# Altium schematic sheet Microcontroller.SchDoc: Microcontroller
size Letter; Date: Jul 31/2018; Revision: 1; SheetNumber: 2; SheetTotal: 9
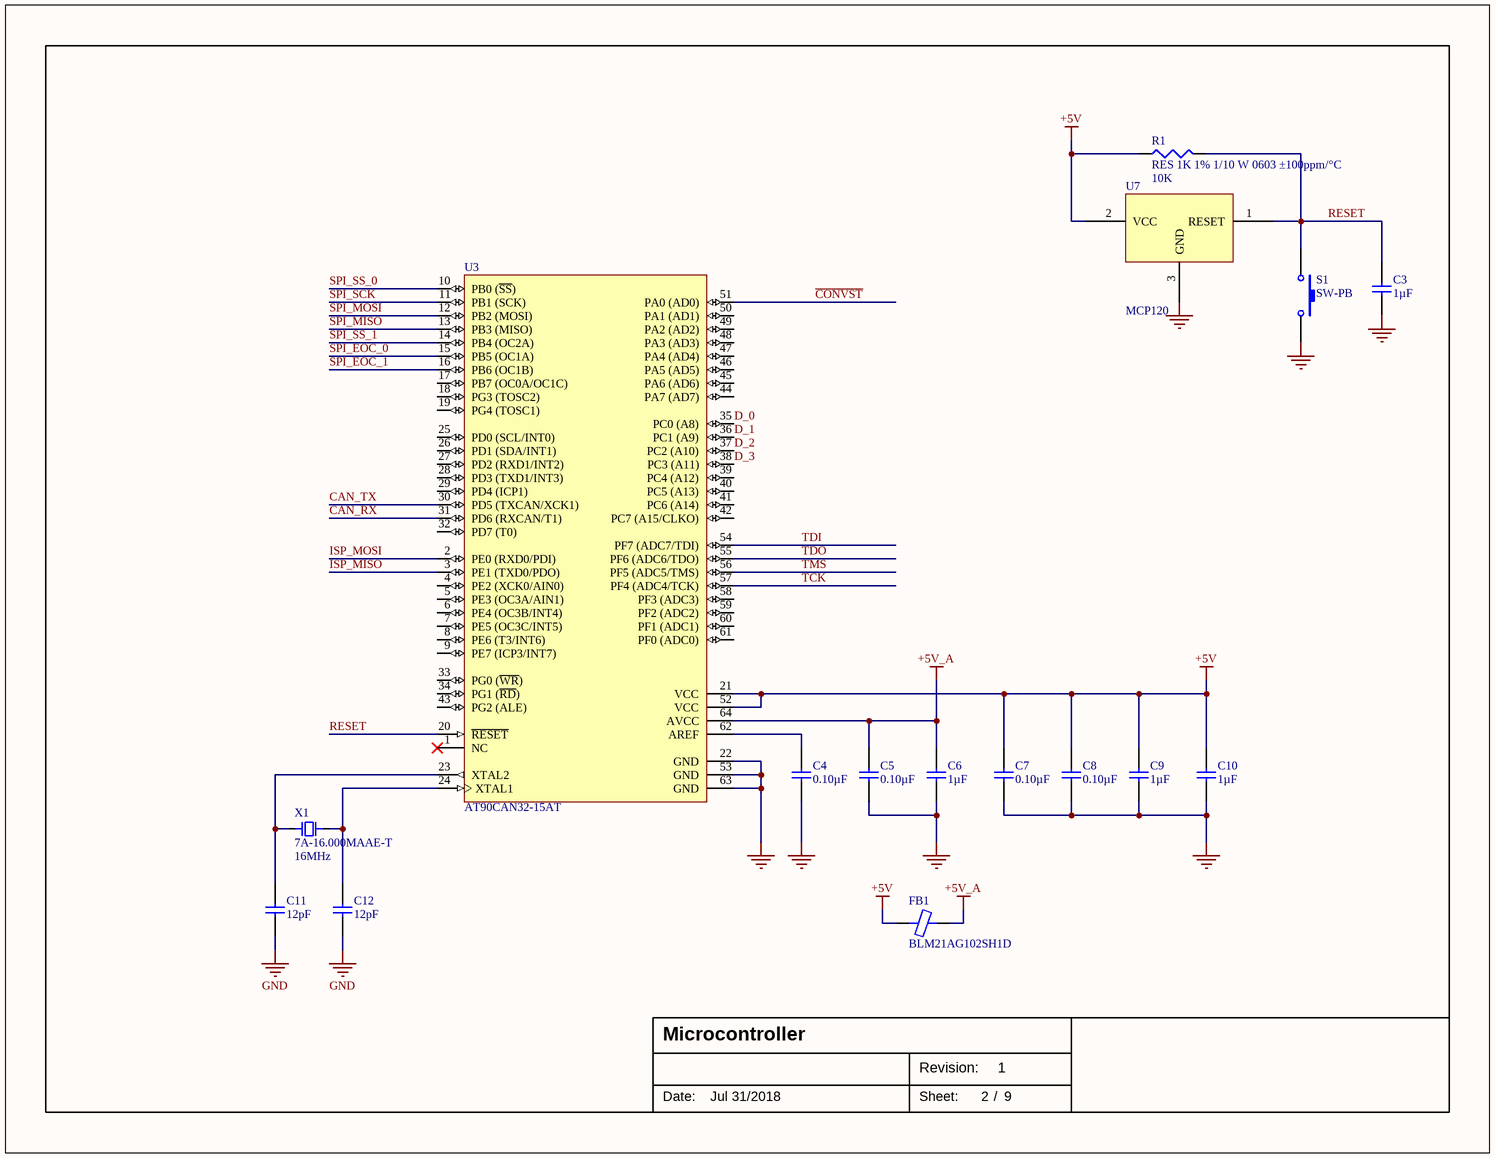
[diagram p0: Microcontroller.SchDoc]

## Parts
C3  value 1µF  [1206]  (hidden comment: CAP 1µF ±10% 16V 0805 X7R)
C4  value 0.10µF  [1206]  (hidden comment: CAP 0.10µF ±10% 16V 0402 X7R)
C5  value 0.10µF  [1206]  (hidden comment: CAP 0.10µF ±10% 16V 0402 X7R)
C6  value 1µF  [1206]  (hidden comment: CAP 1µF ±10% 16V 0805 X7R)
C7  value 0.10µF  [1206]  (hidden comment: CAP 0.10µF ±10% 16V 0402 X7R)
C8  value 0.10µF  [1206]  (hidden comment: CAP 0.10µF ±10% 16V 0402 X7R)
C9  value 1µF  [1206]  (hidden comment: CAP 1µF ±10% 16V 0805 X7R)
C10  value 1µF  [1206]  (hidden comment: CAP 1µF ±10% 16V 0805 X7R)
C11  value 12pF  [1206]  (hidden comment: CAP 12pF ±5% 50V 0402 C0G, NP0)
C12  value 12pF  [1206]  (hidden comment: CAP 12pF ±5% 50V 0402 C0G, NP0)
FB1  BLM21AG102SH1D  [INDC2012X11N]
R1  RES 1K 1% 1/10 W 0603 ±100ppm/°C  value 10K  [1206]
S1  SW-PB  [Switch]
U3  AT90CAN32-15AT  [TQFP80P1600X1600X120-64N]
U7  MCP120  [MCP120]
X1  7A-16.000MAAE-T  value 16MHz  [QFN200P500X320X135-2N]

## Nets
+5V: C7.2 C8.2 C9.1 C10.1 FB1.1 R1.1 U3.21(VCC) U3.52(VCC) U7.2(VCC)
+5V_A: C5.2 C6.1 FB1.2 U3.64(AVCC)
GND: C3.2 C4.1 C5.1 C6.2 C7.1 C8.1 C9.2 C10.2 C11.1 C12.1 S1.2 U3.22(GND) U3.53(GND) U3.63(GND) U7.3(GND)
~{CONVST}: U3.51(PA0_(AD0))
CAN_RX: U3.31(PD6_(RXCAN/T1))
CAN_TX: U3.30(PD5_(TXCAN/XCK1))
D_0: U3.35(PC0_(A8))
D_1: U3.36(PC1_(A9))
D_2: U3.37(PC2_(A10))
D_3: U3.38(PC3_(A11))
ISP_MISO: U3.3(PE1_(TXD0/PDO))
ISP_MOSI: U3.2(PE0_(RXD0/PDI))
RESET: C3.1 R1.2 S1.1 U3.20(~{RESET}) U7.1(RESET)
SPI_EOC_0: U3.15(PB5_(OC1A))
SPI_EOC_1: U3.16(PB6_(OC1B))
SPI_MISO: U3.13(PB3_(MISO))
SPI_MOSI: U3.12(PB2_(MOSI))
SPI_SCK: U3.11(PB1_(SCK))
SPI_SS_0: U3.10(PB0_(~{SS}))
SPI_SS_1: U3.14(PB4_(OC2A))
TCK: U3.57(PF4_(ADC4/TCK))
TDI: U3.54(PF7_(ADC7/TDI))
TDO: U3.55(PF6_(ADC6/TDO))
TMS: U3.56(PF5_(ADC5/TMS))
NetC4_2: C4.2 U3.62(AREF)
NetC11_2: C11.2 U3.23(XTAL2) X1.1
NetC12_2: C12.2 U3.24(XTAL1) X1.2

Not connected (* = marked no-connect by the designer): U3 1(NC)* 4(PE2_(XCK0/AIN0)) 5(PE3_(OC3A/AIN1)) 6(PE4_(OC3B/INT4)) 7(PE5_(OC3C/INT5)) 8(PE6_(T3/INT6)) 9(PE7_(ICP3/INT7)) 17(PB7_(OC0A/OC1C)) 18(PG3_(TOSC2)) 19(PG4_(TOSC1)) 25(PD0_(SCL/INT0)) 26(PD1_(SDA/INT1)) 27(PD2_(RXD1/INT2)) 28(PD3_(TXD1/INT3)) 29(PD4_(ICP1)) 32(PD7_(T0)) 33(PG0_(~{WR})) 34(PG1_(~{RD})) 39(PC4_(A12)) 40(PC5_(A13)) 41(PC6_(A14)) 42(PC7_(A15/CLKO)) 43(PG2_(ALE)) 44(PA7_(AD7)) 45(PA6_(AD6)) 46(PA5_(AD5)) 47(PA4_(AD4)) 48(PA3_(AD3)) 49(PA2_(AD2)) 50(PA1_(AD1)) 58(PF3_(ADC3)) 59(PF2_(ADC2)) 60(PF1_(ADC1)) 61(PF0_(ADC0))

## Notes on the sheet
- Date:
- Revision:
- Sheet:
- /

## Library data of the parts
C3 C6 C9 C10 = CC0805KKX7R7BB105: Manufacturer: Yageo; Manufacturer Series: CC; Part Number: CC0805KKX7R7BB105; Component Type: Standard; Tolerance: ±10%; Voltage: 16V; Package: 0805; Temperature Coefficient: X7R; Temperature Range: -55°C ~ 125°C; Supplier 1: Digi-Key; Supplier Part Number 1: 311-1365-1-ND
C4 C5 C7 C8 = CC0402KRX7R7BB104: Manufacturer: Yageo; Manufacturer Series: CC; Part Number: CC0402KRX7R7BB104; Component Type: Standard; Tolerance: ±10%; Voltage: 16V; Package: 0402; Temperature Coefficient: X7R; Temperature Range: -55°C ~ 125°C; Supplier 1: Digi-Key; Supplier Part Number 1: 311-1338-1-ND
C11 C12 = CC0402JRNPO9BN120: Manufacturer: Yageo; Manufacturer Series: CC; Part Number: CC0402JRNPO9BN120; Component Type: Standard; Tolerance: ±5%; Voltage: 50V; Package: 0402; Temperature Coefficient: C0G, NP0; Temperature Range: -55°C ~ 125°C; Supplier 1: Digi-Key; Supplier Part Number 1: 311-1016-1-ND
R1 = Res3: Resistor; Published: 8-Jun-2000; LatestRevisionDate: 29-May-2009; LatestRevisionNote: IPC-7351 Footprint Added.; PackageReference: J1-0603; Publisher: Altium Limited; PackageDescription: Chip Resistor
S1 = SW-PB: Switch; Published: 24-Mar-1999; LatestRevisionDate: 17-Jul-2002; LatestRevisionNote: Re-released for DXP Platform.; PackageReference: SPST-2; Publisher: Altium Limited; PackageDescription: Switch; 2 Leads
X1 = 7A-16.000MAAE-T: SMD Crystal Oscillator 12 pF; Load Capacitance: 12pF; Supplier 1: Digi-Key; Supplier Part Number 1: 887-1747-1-ND
FB1 = BLM21AG102SH1D: Supplier 1: Digi-Key; Supplier Part Number 1: 490-10664-1-ND
U3 = AT90CAN32-15AT: Supplier 1: Digi-Key; Supplier Part Number 1: AT90CAN32-15ATCT-ND